# EAGLE design Controlboard (EAGLE 9.4.0)
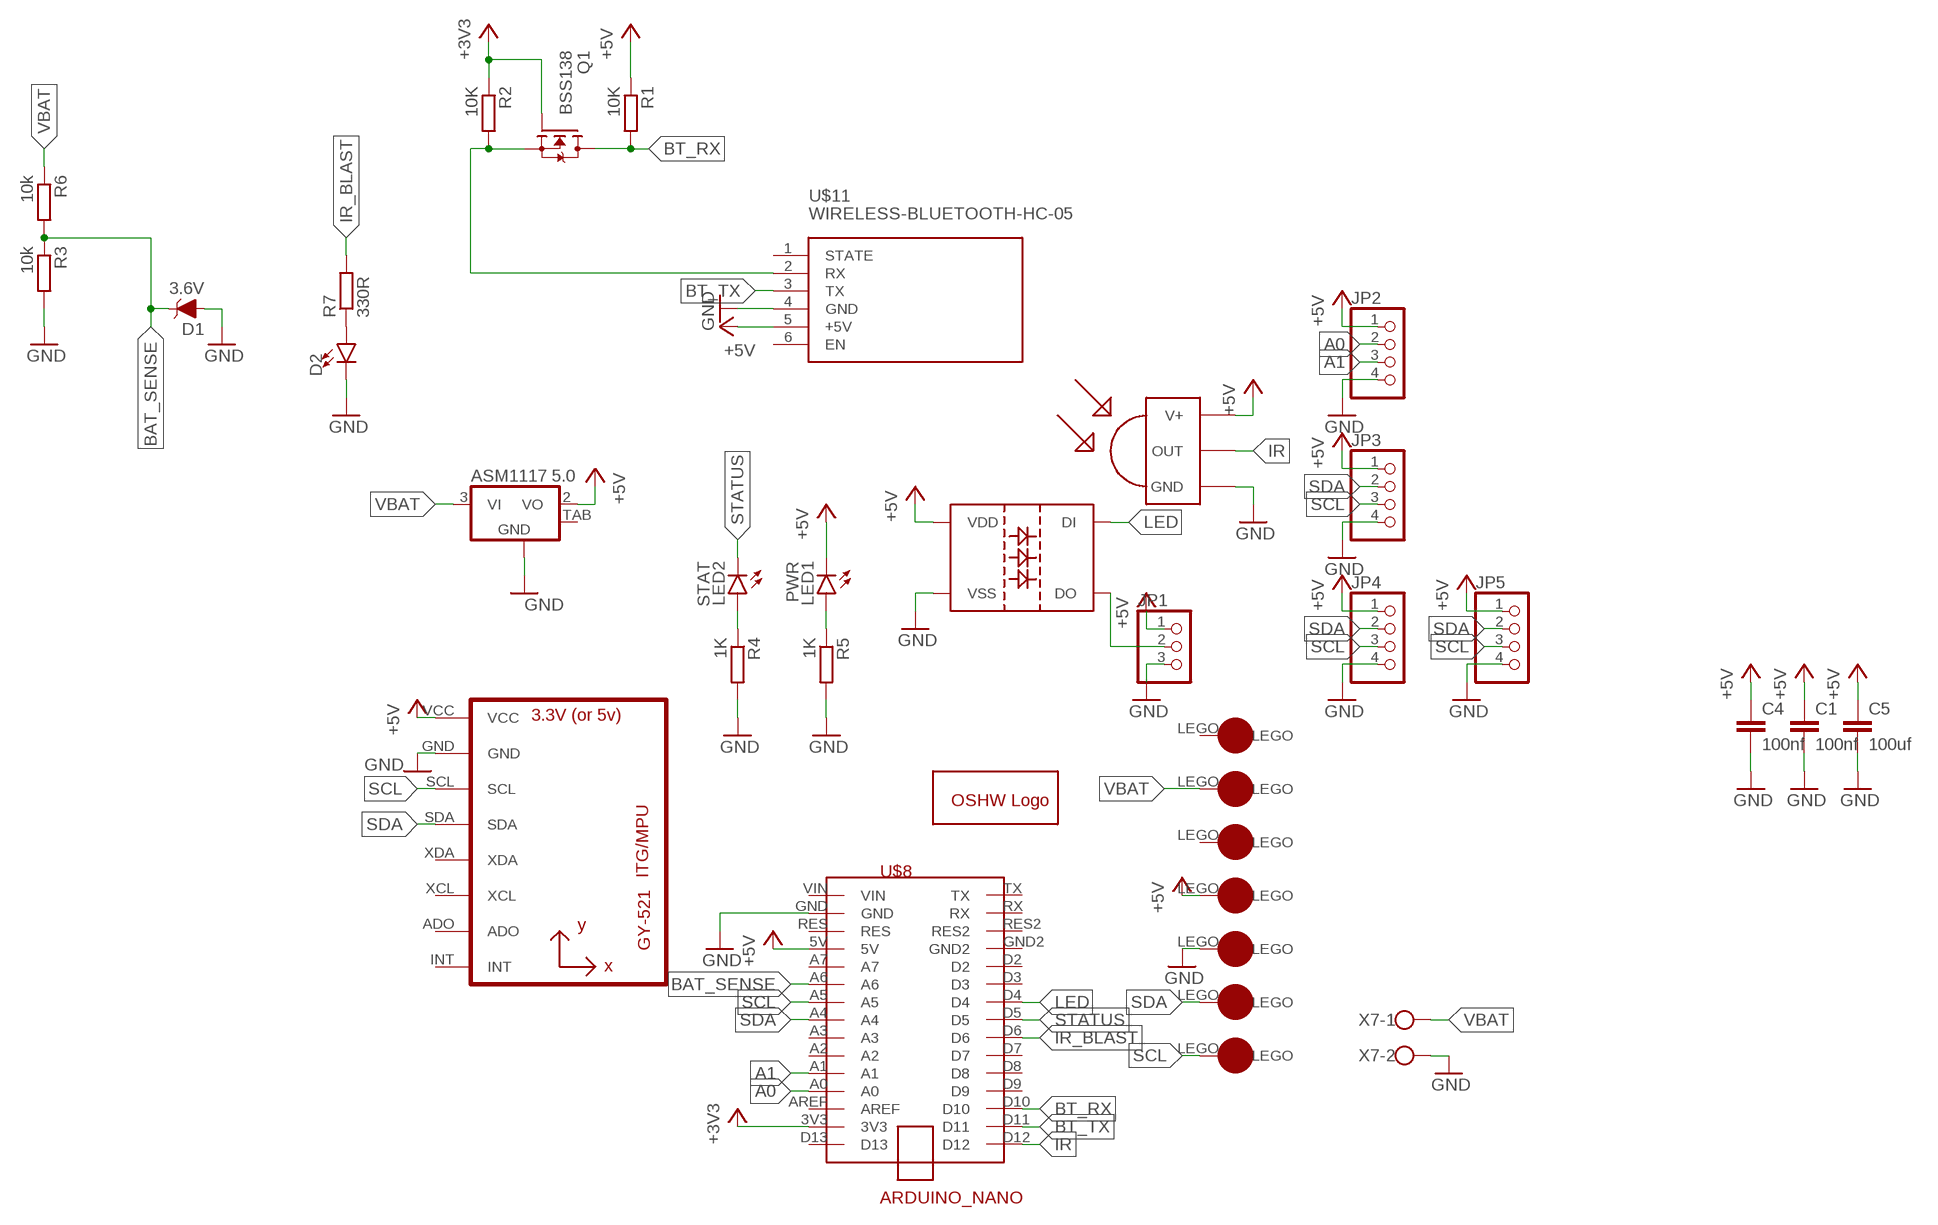
[diagram p0: schematic, sheet 1]

## Parts
C1  100nf  C-EUC1206  [C1206]
C4  100nf  C-EUC1206  [C1206]
C5  100uf  C-EUC1206  [C1206]
D1  3.6V  DIODE-ZENER-BZT52C3V6S  [SOD-323]
D2  LED5MM  [LED_5MM]
JP1  PINHD-1X3  [1X03]
JP2  PINHD-1X4  [1X04]
JP3  PINHD-1X4  [1X04]
JP4  PINHD-1X4  [1X04]
JP5  PINHD-1X4  [1X04]
LED1  PWR  LEDSMT1206  [1206]
LED2  STAT  LEDSMT1206  [1206]
LED3  IND  WS2812B  [WS2812B]
Q1  BSS138  [SOT23]
R1  10K  R-EU_M1206  [M1206]
R2  10K  R-EU_M1206  [M1206]
R3  10k  R-EU_M1206  [M1206]
R4  1K  R-EU_M1206  [M1206]
R5  1K  R-EU_M1206  [M1206]
R6  10k  R-EU_M1206  [M1206]
R7  330R  R-EU_M1206  [M1206]
U1  MPU-6050MPU6050  [MPU-6050]
U$1  LEGO-1X1  [LEGO-1X1]
U$2  OPENSOURCE  [OSHW_5MM]
U$3  LEGO-1X1  [LEGO-1X1]
U$4  LEGO-1X1  [LEGO-1X1]
U$5  LEGO-1X1  [LEGO-1X1]
U$6  LEGO-1X1  [LEGO-1X1]
U$7  LEGO-1X1  [LEGO-1X1]
U$8  ARDUINO_NANO  [ARDUIN_NANO]
U$9  LEGO-1X1  [LEGO-1X1]
U$10  TSOP4838  [TSOP18XX]
U$11  WIRELESS-BLUETOOTH-HC-05  [WIRELESS-BLUETOOTH-HC-05]
U$12  ASM1117 5.0  LM1117  [LM1117]
X7  W237-102  [W237-102]

## Nets
+3V3: Q1.1(G) R2.1 U$8.3V3
+5V: C1.1 C4.1 C5.1 JP1.1 JP2.1 JP3.1 JP4.1 JP5.1 LED1.C LED3.1(VDD) R1.1 U1.VCC U$5.LEGO U$8.5V U$10.VCC(V+) U$11.5(+5V) U$12.2(VO)
A0: JP2.2 U$8.A0
A1: JP2.3 U$8.A1
BAT_SENSE: D1.C R3.1 R6.2 U$8.A6
BT_RX: Q1.3(D) R1.2 U$8.D10
BT_TX: U$8.D11 U$11.3(TX)
GND: C1.2 C4.2 C5.2 D1.A D2.K(C) JP1.3 JP2.4 JP3.4 JP4.4 JP5.4 LED3.3(VSS) R3.2 R4.2 R5.2 U1.GND U$4.LEGO U$8.GND U$10.GND U$11.4(GND) U$12.1(GND) X7.2
IR: U$8.D12 U$10.OUT
IR_BLAST: R7.2 U$8.D6
LED: LED3.4(DI) U$8.D4
N$1: D2.A R7.1
N$2: Q1.2(S) R2.2 U$11.2(RX)
N$3: LED2.A R4.1
N$4: LED1.A R5.1
N$5: JP1.2 LED3.2(DO)
SCL: JP3.3 JP4.3 JP5.3 U1.SCL U$1.LEGO U$8.A5
SDA: JP3.2 JP4.2 JP5.2 U1.SDA U$3.LEGO U$8.A4
STATUS: LED2.C U$8.D5
VBAT: R6.1 U$7.LEGO U$12.3(VI) X7.1
Unconnected: U1.ADO U1.INT U1.XCL U1.XDA U$6.LEGO U$8.A2 U$8.A3 U$8.A7 U$8.AREF U$8.D2 U$8.D3 U$8.D7 U$8.D8 U$8.D9 U$8.D13 U$8.GND2 U$8.RES U$8.RES2 U$8.RX U$8.TX U$8.VIN U$9.LEGO U$11.1(STATE) U$11.6(EN) U$12.TAB(OUT)

## Library data of the parts
C1 C4 C5 = rcl:C-EU: CAPACITOR, European symbol; SPICEPREFIX: C
D1 = SparkFun-DiscreteSemi:DIODE-ZENER: Zener Diode A Zener diode allows current to flow from its anode to its cathode like a normal semiconductor diode, but it also permits current to flow in the reverse direction when its "Zener voltage" is reached. - WIkipedia; PROD_ID: DIO-08199
D2 = SparkFun-LED:LED: LED (Generic) Standard schematic elements and footprints for 5mm, 3mm, 1206, and 0603 sized LEDs. Generic LEDs with no color specified.
JP1 = pinhead:PINHD-1X3: PIN HEADER
JP2-JP5 = pinhead:PINHD-1X4: PIN HEADER
LED1 LED2 = led:LED: LED OSRAM: - CHIPLED LG R971, LG N971, LY N971, LG Q971, LY Q971, LO R971, LY R971 LH N974, LH R974 LS Q976, LO Q976, LY Q976 LO Q996 - Hyper CHIPLED LW Q18S LB Q993, LB Q99A, LB R99A - SideLED LS A670, LO A670, LY A670, LG A670, LP A670 LB A673, LV A673, LT A673, LW A673 LH A674 LY A675 LS A676, LA A676, LO A676, LY A676, LW A676 LS A679, LY A679, LG A679 - Hyper Micro SIDELED® LS Y876, LA Y876, LO Y876, LY Y876 LT Y87S - SmartLED LW L88C, LW L88S LB L89C, LB L89S, LG L890 LS L89K, LO L89K, LY L89K LS L896, LA L896, LO L896, LY L896 - TOPLED LS T670, LO T670, LY T670, LG T670, LP T670 LSG T670, LSP T670, LSY T670, LOP T670, LYG T670 LG T671, LOG T671, LSG T671 LB T673, LV T673, LT T673, LW T673 LH T674 LS T676, LA T676, LO T676, LY T676, LB T676, LH T676, LSB T676, LW T676 LB T67C, LV T67C, LT T67C, LS T67K, LO T67K, LY T67K, LW E67C LS E67B, LA E67B, LO E67B, LY E67B, LB E67C, LV E67C, LT E67C LW T67C LS T679, LY T679, LG T679 LS T770, LO T770, LY T770, LG T770, LP T770 LB T773, LV T773, LT T773, LW T773 LH T774 LS E675, LA E675, LY E675, LS T675 LS T776, LA T776, LO T776, LY T776, LB T776 LHGB T686 LT T68C, LB T68C - Hyper Mini TOPLED® LB M676 - Mini TOPLED Santana® LG M470 LS M47K, LO M47K, LY M47K Source: http://www.osram.convergy.de LUXEON: - LUMILED® LXK2-PW12-R00, LXK2-PW12-S00, LXK2-PW14-U00, LXK2-PW14-V00 LXK2-PM12-R00, LXK2-PM12-S00, LXK2-PM14-U00 LXK2-PE12-Q00, LXK2-PE12-R00, LXK2-PE12-S00, LXK2-PE14-T00, LXK2-PE14-U00 LXK2-PB12-K00, LXK2-PB12-L00, LXK2-PB12-M00, LXK2-PB14-N00, LXK2-PB14-P00, LXK2-PB14-Q00 LXK2-PR12-L00, LXK2-PR12-M00, LXK2-PR14-Q00, LXK2-PR14-R00 LXK2-PD12-Q00, LXK2-PD12-R00, LXK2-PD12-S00 LXK2-PH12-R00, LXK2-PH12-S00 LXK2-PL12-P00, LXK2-PL12-Q00, LXK2-PL12-R00 Source: www.luxeon.com KINGBRIGHT: KA-3528ASYC Source: www.kingbright.com
LED3 = Cing Library:WS2812B
Q1 = Cing Library:BSS138: BSS138 N-Channel Logic Level Enhancement Mode Field Effect Transistor Source: http://www.fairchildsemi.com/datasheets/BS/BSS138.pdf; MF: Fairchild; MPN: BSS138; OC_FARNELL: 9845330; OC_NEWARK: 67R2009
R1-R7 = rcl:R-EU_: RESISTOR, European symbol; SPICEPREFIX: R
U1 = Cing Library:MPU-6050
U$1 U$3-U$7 U$9 = Cing Library:LEGO-1X1
U$2 = Cing Library:OPENSOURCE
U$8 = Arduino_nano:ARDUINO_NANO
U$10 = Cing Library:TSOP4838: IR Receiver and Demodulator
U$11 = Cing Library:WIRELESS-BLUETOOTH-HC-05: Bluetooth Transceiver Module based on HC-05 board Tutorial is available here: https://arduino-info.wikispaces.com/BlueTooth-HC05-HC06-Modules-How-To Click here to find device on ebay.com <http://www.ebay.com/sch/hc-05+module+rs232>
U$12 = Cing Library:LM1117
X7 = con-wago-500:W237-102: WAGO SCREW CLAMP; MPN: 237-102; OC_FARNELL: unknown; OC_NEWARK: 70K9898

## Board
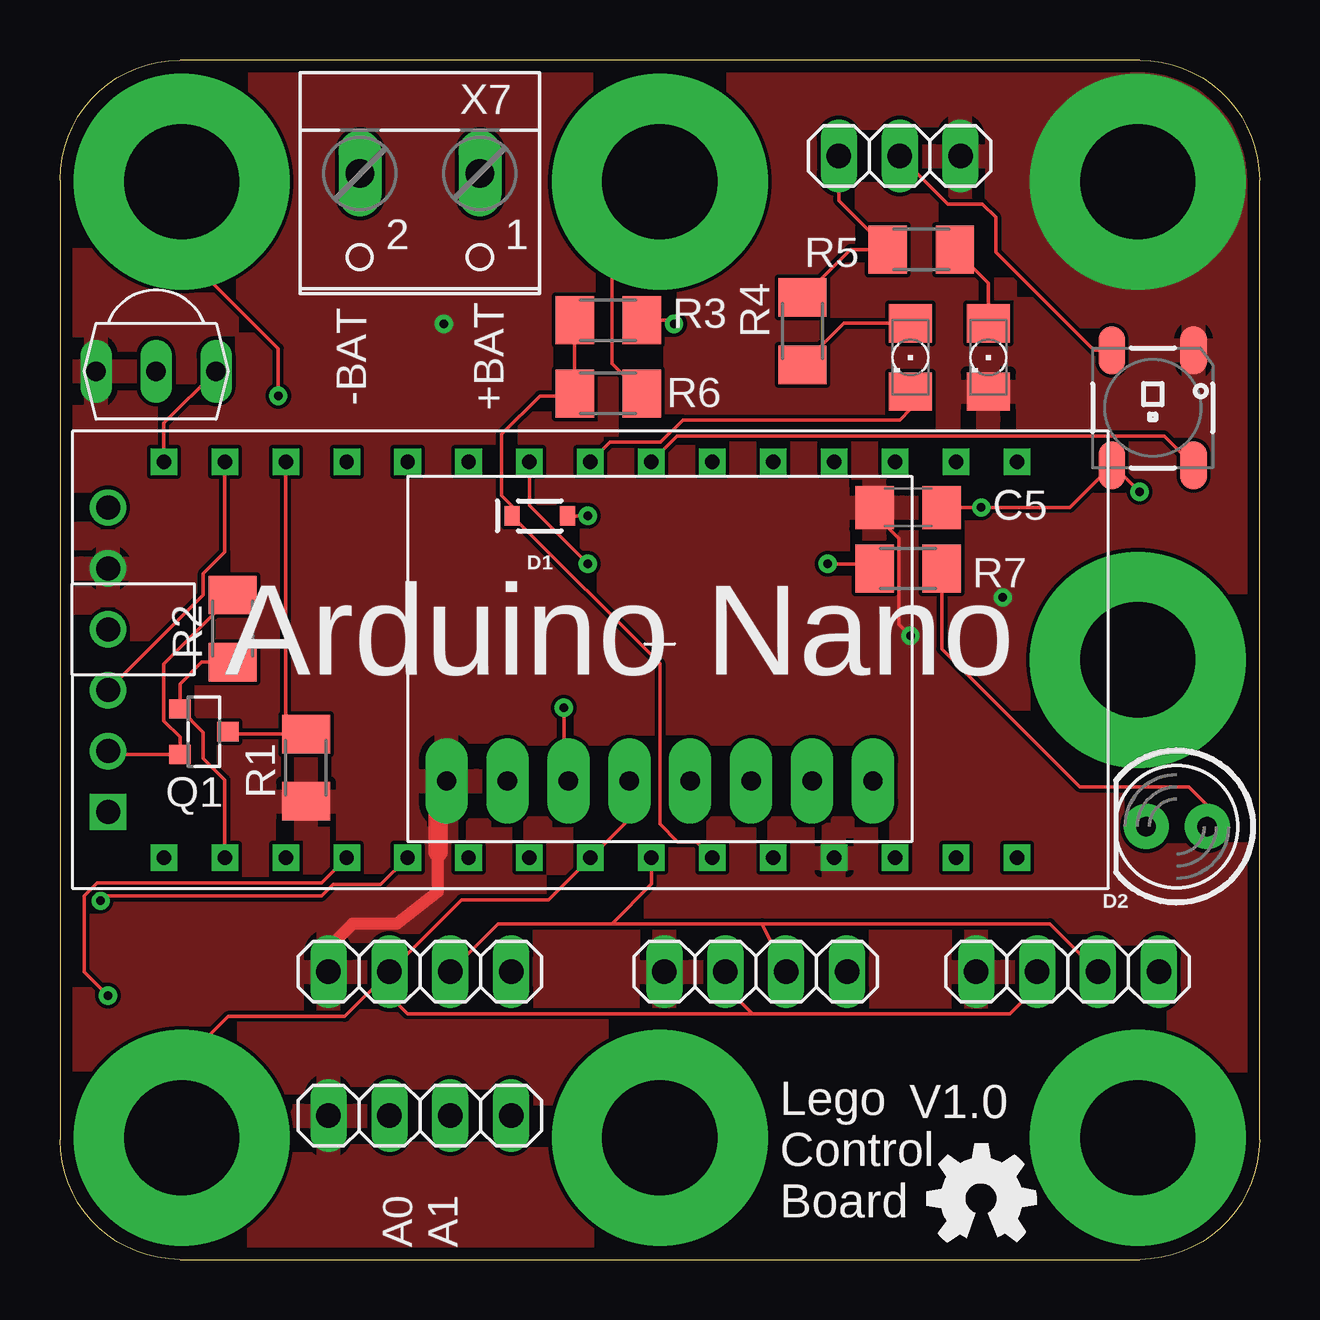
[diagram p1: board, top side]
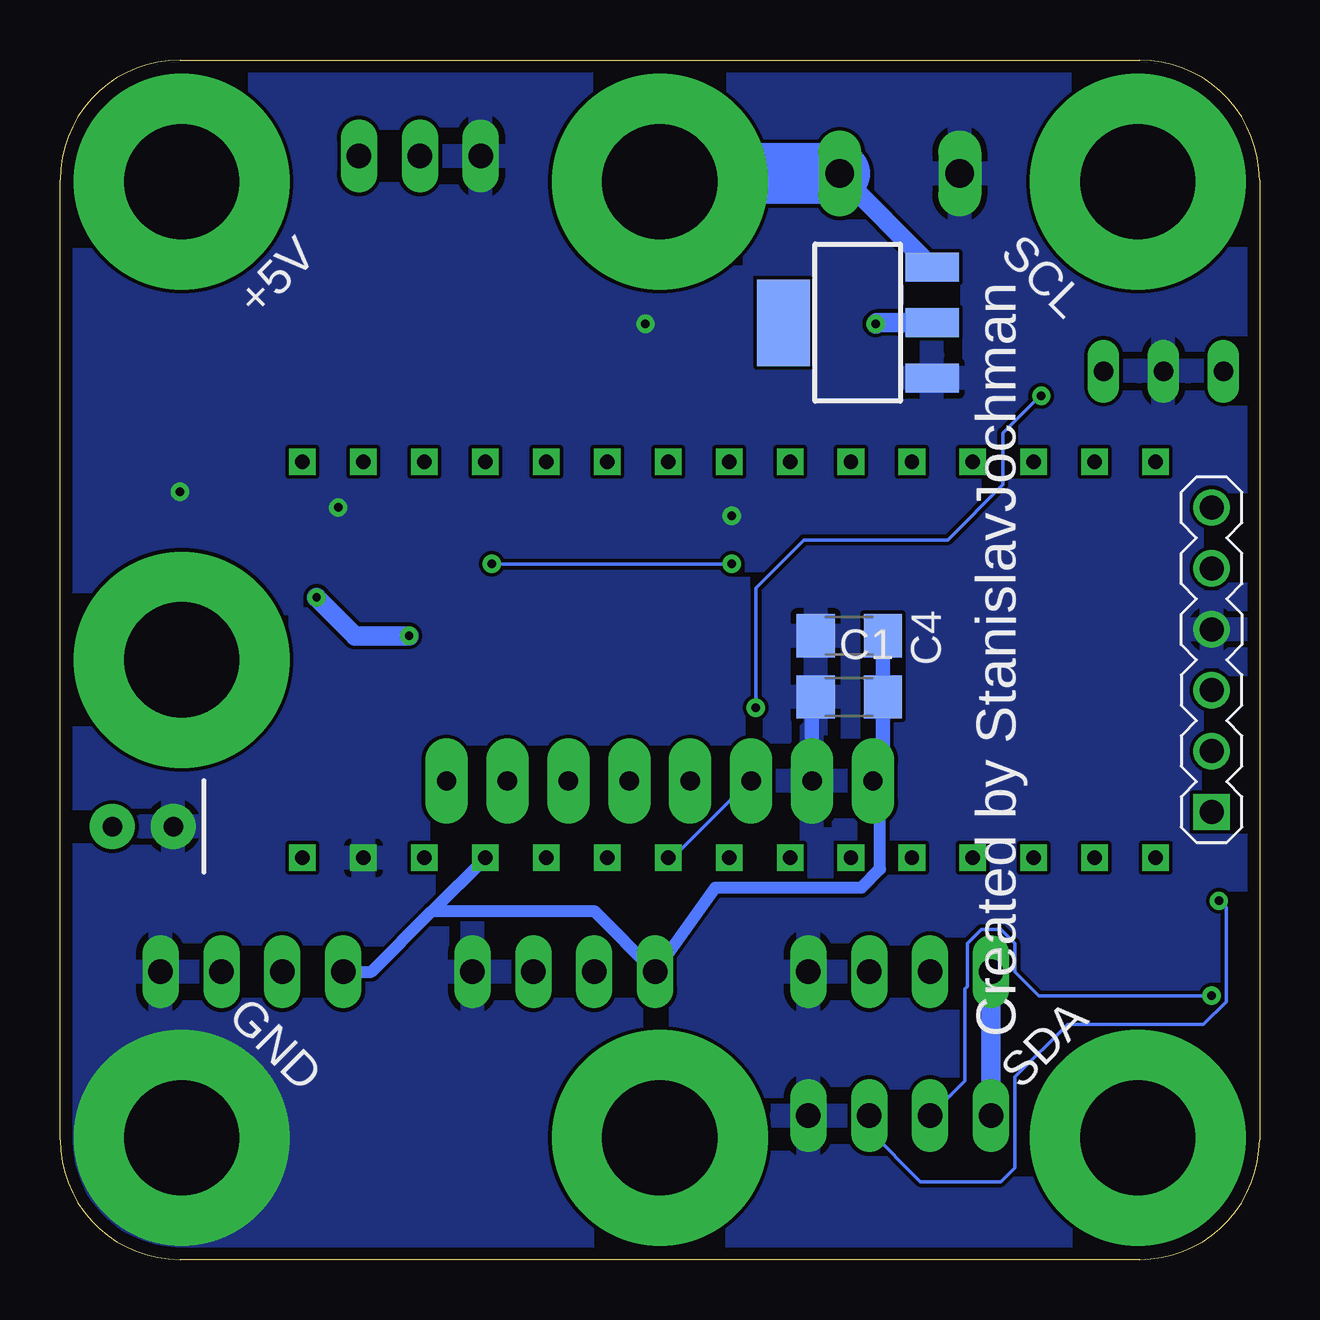
[diagram p2: board, bottom side, seen from below]

Size 50 x 50 mm. Coordinates in mm from the lower left corner, seen from the top.
Outline: 5,0 45,0 arc90 50,5 50,45 arc90 45,50 5,50 arc90 0,45 0,5 arc90 5,0
Copper layers (1*16): Top 0.035mm / dielectric 1.5mm / Bottom 0.035mm
Design rules "default *": minimum track width 6mil, minimum drill 0.35mm, track to track 6mil, track to pad 6mil, pad to pad 6mil, via to via 6mil, smd to smd 6mil, copper to edge 20mil, drill to drill 6mil, minimum pad ring 10mil, minimum via ring 8mil, stop-mask expansion 4mil, vias tented up to drill 0mil, thermal gap 10mil

### Footprints (pad centres in the part's own frame; a part is rotated, then mirrored left to right if it is on the bottom)
C1206 = smd 1.6 x 1.8: 1 -1.4,0; 2 1.4,0
SOD-323 = smd 0.63 x 0.83: A 1.15,0; C -1.15,0
LED_5MM = drill 0.813 pad 1.88: A -1.27,0; K 1.27,0
1X03 = drill 1.016 long: 1 -2.54,0; 2 0,0; 3 2.54,0
1X04 = drill 1.016 long: 1 -3.81,0; 2 -1.27,0; 3 1.27,0; 4 3.81,0
1206 = smd 1.6 x 1.803: A -1.422,0; C 1.422,0
WS2812B = smd 2 x 1.1: 1 -2.4,1.7; 2 -2.4,-1.7; 3 2.4,-1.7; 4 2.4,1.7
SOT23 = smd 0.8 x 0.9: 1 -0.95,-1; 2 0.95,-1; 3 0,1
M1206 = smd 1.6 x 2: 1 -1.4,0; 2 1.4,0
MPU-6050 = drill 0.8 pad 1.778 long: ADO 0,-6.35; GND 0,6.35; INT 0,-8.89; SCL 0,3.81; SDA 0,1.27; VCC 0,8.89; XCL 0,-3.81; XDA 0,-1.27
LEGO-1X1 = drill 4.8 pad 9: LEGO 0,0
ARDUIN_NANO = drill 0.6 square: 3V3 8.255,-36.83; 5V 8.255,-11.43; A0 8.255,-31.75; A1 8.255,-29.21; A2 8.255,-26.67; A3 8.255,-24.13; A4 8.255,-21.59; A5 8.255,-19.05; A6 8.255,-16.51; A7 8.255,-13.97; AREF 8.255,-34.29; D2 -8.255,-13.97; D3 -8.255,-16.51; D4 -8.255,-19.05; D5 -8.255,-21.59; D6 -8.255,-24.13; D7 -8.255,-26.67; D8 -8.255,-29.21; D9 -8.255,-31.75; D10 -8.255,-34.29; D11 -8.255,-36.83; D12 -8.255,-39.37; D13 8.255,-39.37; GND 8.255,-6.35; GND2 -8.255,-11.43; RES 8.255,-8.89; RES2 -8.255,-8.89; RX -8.255,-6.35; TX -8.255,-3.81; VIN 8.255,-3.81
TSOP18XX = drill 0.813 long: GND -0.001,-0.027; OUT -2.501,-0.027; VCC 2.499,-0.027
WIRELESS-BLUETOOTH-HC-05 = drill 1 square: 1 -6.35,0 | drill 1: 2 -3.81,0; 3 -1.27,0; 4 1.27,0; 5 3.81,0; 6 6.35,0
LM1117 = smd 1.219 x 2.235: 1 -2.311,-3.099; 2 0,-3.099; 3 2.311,-3.099 | smd 3.6 x 2.2: TAB 0,3.099
W237-102 = drill 1.194 long: 1 -2.5,-1.27; 2 2.5,-1.27

### Placement (x,y rotation side)
C1  17.1,23.45 180 bottom
C4  17.1,26 180 bottom
C5  35.35,31.35 0 top
D1  20,31 0 top
D2  46.55,18.05 180 top
JP1  35,46 180 top
JP2  15,6 0 top
JP3  29,12 0 top
JP4  42,12 0 top
JP5  15,12 0 top
LED1  38.7,37.6 270 top
LED2  35.45,37.6 270 top
LED3  45.55,35.5 270 top
Q1  6,22 270 top
R1  10.25,20.5 90 top
R2  7.2,26.3 90 top
R3  22.85,39.15 0 top
R4  30.95,38.7 90 top
R5  35.9,42.1 180 top
R6  22.85,36.1 180 top
R7  35.35,28.8 180 top
U1  25,19.95 90 top
U$1  5.07,44.92 0 top
U$2  38.4,2.54 0 top
U$3  5.07,5.07 0 top
U$4  44.92,5.07 0 top
U$5  44.92,44.92 0 top
U$6  25,5.07 0 top
U$7  25,44.92 0 top
U$8  43.7,25 270 top
U$9  44.92,25 0 top
U$10  4,37 180 top
U$11  2,25 90 bottom
U$12  16.75,39.05 90 bottom
X7  15,44 180 top

### Tracks (layer width: path | path; a pad name or v marks a point on that pad's centre or on a via)
+3V3
  Top 0.152: R2.1 5.9,24.9 5,24 Q1.1 5.98,21.98 5.98,20.89 6.87,20 U$8.3V3
+5V  (via drill 0.35)
  Top 0.152: C5.1 33.95,31.07 34.98,30.05 34.98,26.47 v35.45,26
  Top 0.508: JP5.1 11.19,13 12.19,14 14.03,14 15.75,15.34 15.75,17
  Top 0.813: U1.VCC 15.75,19.59 15.75,17
  Bottom 0.152: 15.7,24 C1.1
  Bottom 0.508: JP4.1 37.02,12 34.51,14.51 | 34.51,14.51 U$8.5V | 34.51,14.51 27.7,14.51 JP3.1 22.69,15.5 16.59,15.5 15.82,16.27 15.82,19.66 U1.VCC
  Bottom 0.61: C4.1 15.7,24 | U1.VCC 15.7,20.36 C1.1
  Bottom 0.813: U$12.2 15.95,39.05 v16,39 | v35.45,26 37.7,26 v39.3,27.6 | JP5.1 JP2.1
  pour Top: -5,55 55,55 55,-5 -5,-5
A0  (via drill 0.35)
  Top 0.152: v2,11 1,12 1,15.15 1.55,15.7 10.91,15.7 U$8.A0
  Bottom 0.152: JP2.2 12.28,7.45 12.28,11.28 12.18,11.39 12.18,13.17 11.6,13.75 10.78,13.75 10.2,13.17 10.2,12 9.2,11 v2,11
A1  (via drill 0.35)
  Top 0.152: v1.69,14.95 1.89,15.15 10.9,15.15 11.38,15.63 13.37,15.63 U$8.A1
  Bottom 0.152: v1.69,14.95 1.67,14.95 1.39,14.67 1.39,10.75 2.34,9.8 8,9.8 10.2,7.6 10.2,3.83 10.78,3.25 14.14,3.25 16.27,5.38 JP2.3
BAT_SENSE
  Top 0.152: R3.1 R6.2 21.35,36 20,36 18.4,34.4 18.4,31.85 18.85,31.4 D1.C 25,24.85 25,18.15 25.74,17.41 26.52,17.41 U$8.A6
BT_RX
  Top 0.152: Q1.3 7.1,21.9 R1.2 9.41,22.74 U$8.D10
BT_TX
  Top 0.152: U$8.D11 6.87,29.49 5.97,28.59 5.97,27.7 U$11.3
GND  (via drill 0.35)
  Top 0.152: v45,32 43.9,33.1 LED3.3 42.1,31.35 v38.4,31.35 C5.2 | JP1.3 32.46,44.14 R5.2 32.95,42.1 R4.2 | R3.2 25.45,39.15 v25.6,39 | D1.A v22,31
  Bottom 0.152: 18.65,20 U1.GND
  Bottom 0.61: C1.2 18.65,23.3 18.65,20
  pour Bottom: -5,55 55,55 55,-5 -5,-5
IR
  Top 0.152: U$8.D12 4.33,34.86 U$10.OUT
IR_BLAST  (via drill 0.35)
  Top 0.152: v22,29 19.57,31.43 U$8.D6 | R7.2 33.75,29 v32,29
  Bottom 0.152: v32,29 v22,29
LED
  Top 0.152: LED3.4 46.02,34.33 25.72,34.33 U$8.D4
N$1
  Top 0.152: R7.1 36.75,25.45 42.5,19.7 47.05,19.7 47.82,18.93 D2.A
N$2
  Top 0.152: U$11.2 2.14,21.05 Q1.2 5,21.78 4.32,22.45 4.32,24.82 R2.2
N$3
  Top 0.152: R4.1 32.67,39.02 LED2.A
N$4
  Top 0.152: R5.1 38.7,40.7 LED1.A
N$5
  Top 0.152: LED3.2 43.1,37.9 39,42 39,43.45 38.45,44 37,44 JP1.2
SCL  (via drill 0.35)
  Top 0.152: U1.SCL 21,20.14 v21,23 | U$1.LEGO 5.07,42 9.1,37.98 v9.1,36 | 23,14 18.27,14 JP5.3 | 23,14 24.65,15.65 U$8.A5 | 23,14 29.27,14 | JP3.3 29.27,14 | 29.27,14 41.27,14 JP4.3
  Bottom 0.152: v9.1,36 9.15,36 10.7,34.45 10.7,32.3 13,30 19,30 21,28 v21,23 | U1.SCL 21.26,19.95 24.46,16.74 U$8.A5
SDA
  Top 0.152: U1.SDA 23.73,18.37 U$8.A4 20.37,15 16.73,15 JP5.2 | JP5.2 11.87,10.13 7,10.13 5.07,8.21 U$3.LEGO | JP4.2 40.73,11.38 39.6,10.25 28.86,10.25 | JP3.2 27.73,11.38 28.86,10.25 | 28.86,10.25 14.48,10.25 13.73,11 JP5.2
STATUS
  Top 0.152: U$8.D5 22.93,34.07 25.04,34.07 25.96,35 35,35 35.45,35.45 LED2.C
VBAT
  Top 0.152: R6.1 23,37.35 23,42.92 U$7.LEGO
  Bottom 0.813: U$12.3 17.5,45.21 X7.1
  Bottom 2.54: X7.1 24.66,45.27 U$7.LEGO

### Text on the board
tNames: -BAT / / / +BAT | V1.0 | Lego / Control / Board | A0 / A1
bNames: SCL | +5V | Created by StanislavJochman | SDA | GND